# Altium schematic sheet TopSheet.SchDoc
size A4; SheetNumber: 1; SheetTotal: 4
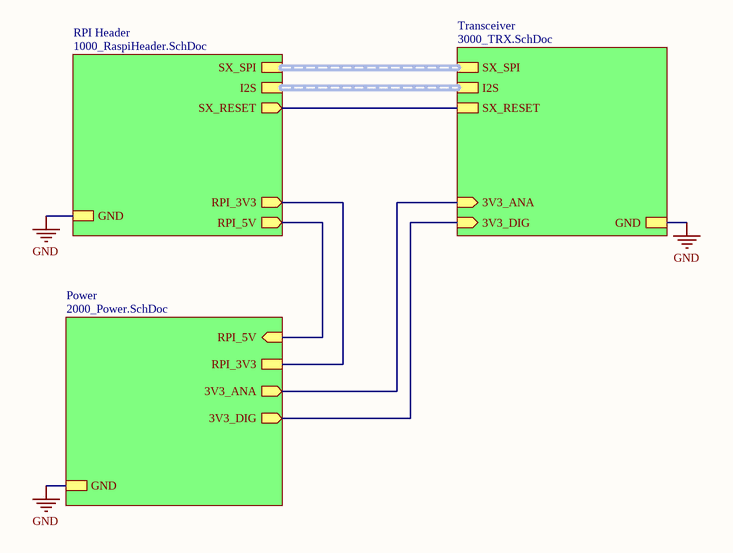
[diagram p0: TopSheet.SchDoc]

## Sub-sheets
Power = 2000_Power.SchDoc: RPI_3V3, RPI_5V (in), 3V3_ANA (out), 3V3_DIG (out), GND
RPI Header = 1000_RaspiHeader.SchDoc: RPI_3V3 (out), RPI_5V (out), GND, SX_SPI, I2S, SX_RESET (out)
Transceiver = 3000_TRX.SchDoc: 3V3_ANA (in), 3V3_DIG (in), GND, SX_SPI, I2S, SX_RESET

## Nets
GND: sheet RPI Header/GND, sheet Transceiver/GND, sheet Power/GND
(unnamed): sheet RPI Header/RPI_3V3, sheet Power/RPI_3V3
(unnamed): sheet RPI Header/RPI_5V, sheet Power/RPI_5V
(unnamed): sheet RPI Header/SX_RESET, sheet Transceiver/SX_RESET
(unnamed): sheet Transceiver/3V3_ANA, sheet Power/3V3_ANA
(unnamed): sheet Transceiver/3V3_DIG, sheet Power/3V3_DIG

## Buses and harness runs
harness sheet RPI Header/I2S = sheet Transceiver/I2S
harness sheet RPI Header/SX_SPI = sheet Transceiver/SX_SPI